# Altium project 20bit_40MS_ADC_DIOT.PrjPcb (part 2 of 5)

## Sheet ADC.SchDoc: AD4080
size A3; Author: M.Beldyga; CompanyName: Aescape, Inc.; DrawnBy: M.Beldyga; Organization: Aescape, Inc.; Address1: Aescape, Inc.; Address2: 581 6th Ave, New York, NY 10011; Address3: michal@aescape.com; SheetNumber: 2; SheetTotal: 10; ModifiedBy: -; CheckedDate: -; Title2: 20b 40Msps ADC; DivGrp: Aescape, Inc.; Designer: M.Beldyga; ModifiedDate: -; ProjectName: Sensor Box
Used 2 times, as channels U_ADC, U_ADC. Parts and nets are listed once, with the designators drawn on the sheet.
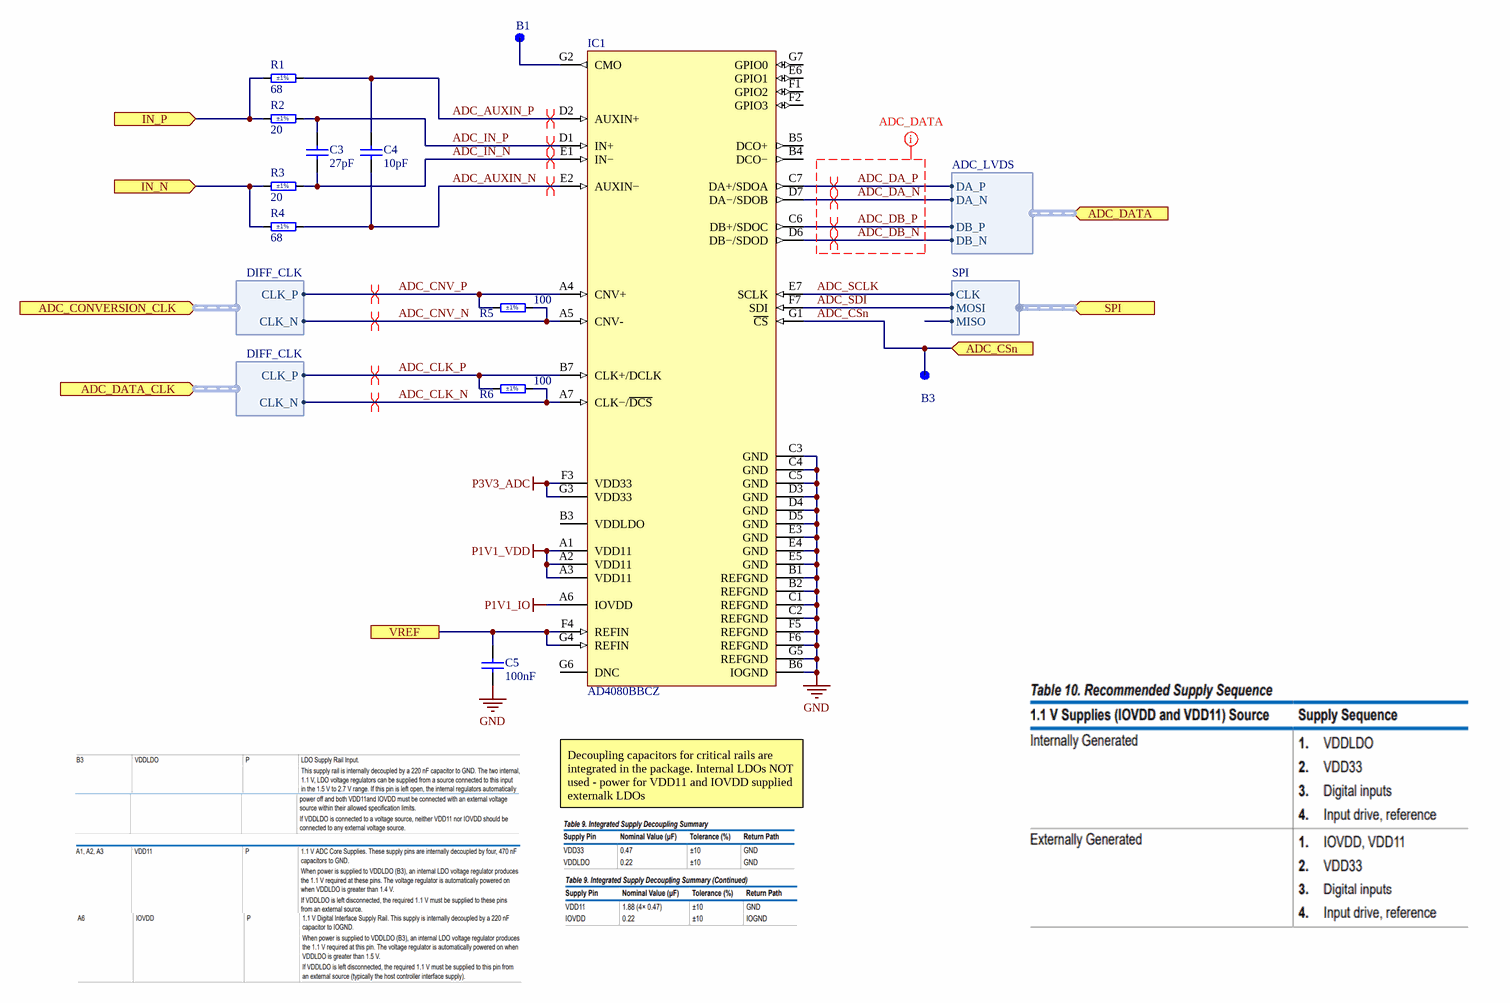
[diagram p4: ADC.SchDoc]

### Parts
B1  SMD Pad  [C100]  (value not drawn)  (no BOM)
B3  SMD Pad  [C100]  (value not drawn)  (no BOM)
C3  27pF  [CAPC1005X55N]
C4  10pF  [CAPC1005X55N]
C5  100nF  [CAPC1005X55N]
IC1  AD4080BBCZ  [BGA49C65P7X7_500X500X138]
R1  68  Tolerance: ±1%  [RESC1005X40N]
R2  20  Tolerance: ±1%  [RESC1005X40N]
R3  20  Tolerance: ±1%  [RESC1005X40N]
R4  68  Tolerance: ±1%  [RESC1005X40N]
R5  100  Tolerance: ±1%  [RESC1005X40N]
R6  100  Tolerance: ±1%  [RESC1005X40N]

### Ports
ADC_CONVERSION_CLK (in, harness DIFF_CLK), ADC_CSn (in), ADC_DATA (in, harness ADC_LVDS), ADC_DATA_CLK (in, harness DIFF_CLK), IN_N (in), IN_P (in), SPI (in, harness SPI), VREF

### Harnesses
ADC_LVDS: DA_P, DA_N, DB_P, DB_N
DIFF_CLK: CLK_P, CLK_N
SPI: CLK, MOSI, MISO

### Nets
GND: C5.1 IC1.B1(REFGND) IC1.B2(REFGND) IC1.B6(IOGND) IC1.C1(REFGND) IC1.C2(REFGND) IC1.C3(GND) IC1.C4(GND) IC1.C5(GND) IC1.D3(GND) IC1.D4(GND) IC1.D5(GND) IC1.E3(GND) IC1.E4(GND) IC1.E5(GND) IC1.F5(REFGND) IC1.F6(REFGND) IC1.G5(REFGND)
P1V1_IO: IC1.A6(IOVDD)
P1V1_VDD: IC1.A1(VDD11) IC1.A2(VDD11) IC1.A3(VDD11)
P3V3_ADC: IC1.F3(VDD33) IC1.G3(VDD33)
ADC_AUXIN_N: C4.1 IC1.E2(AUXIN−) R4.2
ADC_AUXIN_P: C4.2 IC1.D2(AUXIN+) R1.2
ADC_CLK_N: IC1.A7(CLK−/~{DCS}) R6.2 ; port ADC_DATA_CLK.CLK_N
ADC_CLK_P: IC1.B7(CLK+/DCLK) R6.1 ; port ADC_DATA_CLK.CLK_P
ADC_CNV_N: IC1.A5(CNV-) R5.2 ; port ADC_CONVERSION_CLK.CLK_N
ADC_CNV_P: IC1.A4(CNV+) R5.1 ; port ADC_CONVERSION_CLK.CLK_P
ADC_CSn: B3.1 IC1.G1(~{CS}) ; port ADC_CSn
ADC_DA_N: IC1.D7(DA−/SDOB) ; port ADC_DATA.DA_N
ADC_DA_P: IC1.C7(DA+/SDOA) ; port ADC_DATA.DA_P
ADC_DB_N: IC1.D6(DB−/SDOD) ; port ADC_DATA.DB_N
ADC_DB_P: IC1.C6(DB+/SDOC) ; port ADC_DATA.DB_P
ADC_IN_N: C3.1 IC1.E1(IN−) R3.2
ADC_IN_P: C3.2 IC1.D1(IN+) R2.2
ADC_SCLK: IC1.E7(SCLK) ; port SPI.CLK
ADC_SDI: IC1.F7(SDI) ; port SPI.MOSI
IN_N: R3.1 R4.1 ; port IN_N
IN_P: R1.1 R2.1 ; port IN_P
VREF: C5.2 IC1.F4(REFIN) IC1.G4(REFIN) ; port VREF
NetB1_1: B1.1 IC1.G2(CMO)

Not connected (* = marked no-connect by the designer): IC1 B3(VDDLDO) B4(DCO−) B5(DCO+) E6(GPIO1) F1(GPIO2) F2(GPIO3) G6(DNC) G7(GPIO0)

### Channels
U_ADC: designators end in B; ports ADC_CSn=ADC_CSn IN_N=ADCIN_N IN_P=ADCIN_P VREF=P3V0_REF
U_ADC: designators end in A; ports ADC_CSn=ADC_CSn IN_N=ADCIN_N IN_P=ADCIN_P VREF=P3V0_REF

### Layout directives
differential pair; net class ADC_IN: ADC_AUXIN_N_U_ADC, ADC_AUXIN_P_U_ADC, ADC_IN_N_U_ADC, ADC_IN_P_U_ADC
differential pair; net class D100: AD9508_OUT0_N, AD9508_OUT0_P, AD9508_OUT1_N, AD9508_OUT1_P, ADC_DA_N, ADC_DA_P, ADC_DB_N, ADC_DB_P
net class ADC_DATA: ADC_DA_N, ADC_DA_P, ADC_DB_N, ADC_DB_P

### Notes on the sheet
- Decoupling capacitors for critical rails are integrated in the package. Internal LDOs NOT used - power for VDD11 and IOVDD supplied externalk LDOs
- Project/Equipment
- Document
- Designer
- Drawn by
- Check.by
- Contact
- File
- Last Mod.
- Print Date
- Sheet
- Size
- A3
- of
- Rev

### Library data of the parts
B1 B3 = SMD_PAD_D1MM: as B4 on sheet LNA; Part Number: SMD_PAD_D1MM; Component Type: Standard (No BOM); Pin Count: 1; Family: SMD Pad; Socket: No; SMD: Yes; Sense: No; Status: None; ComponentHeight: 0mm; HelpURL: Undefined; Author: CERN DEM JLC; CreateDate: 10/10/2017; LatestRevisionDate: 10/10/2017; PackageDescription: 1mm Diameter SMD Pad
C3 = CC0402_27PF_50V_5%_C0G: Non-polarised capacitor; Part Description: SMD Multilayer Chip Ceramic Capacitor; Manufacturer: GENERIC; Manufacturer1 Part Number: C0402C270J5GACTU; Voltage: 50V; TC: C0G/NP0; Tolerance: ±5%; Part Number: CC0402_27PF_50V_5%_C0G; Component Kind: Standard; Component Type: Standard; Pin Count: 2; Value: 27pF; Status: Preferred; Manufacturer Part Number: CC0402_27PF_50V_5%_C0G; Case: 0402; Mounted: Yes; Socket: No; SMD: Yes; Sense: No; Manufacturer1 Example: KEMET; Manufacturer1 ComponentHeight: 0.55mm; HelpURL: \\cern.ch\dfs\Applications\Altium\Datasheets\CC0402_C0G_KEMET_(Commercial Grade).pdf; Author: CERN DEM JLC; CreateDate: 10/25/2012; LatestRevisionDate: 4/22/2015
C4 = CC0402_10PF_50V_5%_C0G: Non-polarised capacitor; Part Description: SMD Multilayer Chip Ceramic Capacitor; Manufacturer: GENERIC; Manufacturer1 Part Number: C0402C100J5GACTU; Voltage: 50V; TC: C0G/NP0; Tolerance: ±5%; Part Number: CC0402_10PF_50V_5%_C0G; Component Kind: Standard; Component Type: Standard; Pin Count: 2; Value: 10pF; Status: Preferred; Manufacturer Part Number: CC0402_10PF_50V_5%_C0G; Case: 0402; Mounted: Yes; Socket: No; SMD: Yes; Sense: No; Manufacturer1 Example: KEMET; Manufacturer1 ComponentHeight: 0.55mm; HelpURL: \\cern.ch\dfs\Applications\Altium\Datasheets\CC0402_C0G_KEMET_(Commercial Grade).pdf; Author: CERN DEM JLC; CreateDate: 12/3/2007; LatestRevisionDate: 4/22/2015
C5 = CC0402_100NF_50V_10%_X7R: as C1 on sheet CPCIS_Connectors_P1_P6; Part Number: CC0402_100NF_50V_10%_X7R; Component Kind: Standard; Component Type: Standard; Pin Count: 2; Value: 100nF; Status: None; Manufacturer Part Number: CC0402_100NF_50V_10%_X7R; Case: 0402; Mounted: Yes; Socket: No; SMD: Yes; Sense: No; Manufacturer1 Example: MURATA; Manufacturer1 ComponentHeight: 0.55mm; HelpURL: \\cern.ch\dfs\Applications\Altium\Datasheets\CC0402_MURATA_GRM155R71H104KE14D.pdf; Author: CERN DEM MR; CreateDate: 6/30/2017; LatestRevisionDate: 6/30/2017
IC1 = AD4080BBCZ: 20-Bit, 40 MSPS, Differential SAR ADC; Manufacturer: Analog Devices; Part Number: AD4080BBCZ; Component Kind: Standard; Component Type: Standard; Device: AD4080BBCZ; PackageDescription: BGA, 49-Leads, Body 5.00x5.00mmx1.38mm, Pitch 0.65mm; Part Description: 20-Bit, 40 MSPS, Differential SAR ADC; Manufacturer Part Number: AD4080BBCZ; Pin Count: 49; Case: BGA; Status: Active; Author: Michal Beldyga; CreateDate: 1/31/2025; LastRevision: 1/31/2025
R1 R4 = R0402_68R_1%_0.0625W_100PPM: Resistor - 1%; Part Description: General Purpose Thick Film Chip Resistor; Manufacturer: GENERIC; Manufacturer1 Part Number: 232270676809L; TC: ±100ppm/°C; PressFit: No; Part Number: R0402_68R_1%_0.0625W_100PPM; Component Kind: Standard; Component Type: Standard; Pin Count: 2; Value: 68; Status: Not Recommended; Power: 0.0625W; Manufacturer Part Number: R0402_68R_1%_0.0625W_100PPM; Case: 0402; Mounted: Yes; Sense: No; Socket: No; SMD: Yes; Manufacturer1 Example: YAGEO PHYCOMP; Manufacturer1 ComponentHeight: 0.4mm; HelpURL: \\cern.ch\dfs\Applications\Altium\Datasheets\R0402_Phycomp_RC0402.pdf; Author: CERN DEM JLC; CreateDate: 12/3/2007; LatestRevisionDate: 10/17/2012
R2 R3 = R0402_20R_1%_0.0625W_100PPM: Resistor - 1%; Part Description: General Purpose Thick Film Chip Resistor; Manufacturer: GENERIC; Manufacturer1 Part Number: 232270672009L; TC: ±100ppm/°C; PressFit: No; Part Number: R0402_20R_1%_0.0625W_100PPM; Component Kind: Standard; Component Type: Standard; Pin Count: 2; Value: 20; Status: Not Recommended; Power: 0.0625W; Manufacturer Part Number: R0402_20R_1%_0.0625W_100PPM; Case: 0402; Mounted: Yes; Sense: No; Socket: No; SMD: Yes; Manufacturer1 Example: YAGEO PHYCOMP; Manufacturer1 ComponentHeight: 0.4mm; HelpURL: \\cern.ch\dfs\Applications\Altium\Datasheets\R0402_Phycomp_RC0402.pdf; Author: CERN DEM JLC; CreateDate: 12/3/2007; LatestRevisionDate: 10/17/2012
R5 R6 = R0402_100R_1%_0.1W_100PPM: Resistor - 1%; Part Description: General Purpose Thick Film Chip Resistor; Manufacturer: GENERIC; Manufacturer Part Number: R0402_100R_1%_0.1W_100PPM_50V; Manufacturer1 Part Number: ERJ2RKF1000X; Power: 0.1W; TC: ±100ppm/°C; Voltage: 50V; PressFit: No; Part Number: R0402_100R_1%_0.1W_100PPM; Component Kind: Standard; Component Type: Standard; Pin Count: 2; Value: 100; Status: Not Recommended; Case: 0402; Mounted: Yes; Sense: No; Socket: No; SMD: Yes; Manufacturer1 Example: PANASONIC; Manufacturer1 ComponentHeight: 0.4mm; HelpURL: \\cern.ch\dfs\Applications\Altium\Datasheets\R0402_PANASONIC_ERJ2RK.pdf; Author: CERN DEM JLC; CreateDate: 12/12/2013; LatestRevisionDate: 3/3/2015

## Sheet PLL.SchDoc: PLL
size A3; Author: M.Beldyga; CompanyName: WUT ISE; DrawnBy: M.Beldyga; Organization: WUT ISE; Address1: PW ISE; Address2: Nowowiejska 15/19 00-665 Warsaw; Address3: micbeldyga@gmail.com; SheetNumber: 5; SheetTotal: 10; ModifiedBy: -; CheckedDate: -; Title2: ADC clocks; DivGrp: WUT ISE; Designer: M.Beldyga; SPICEModelCacheKGJAJCJD: <root> / <DocumentId>KGJAJCJD</DocumentId> / </root>; ModifiedDate: -; ProjectName: Sensor Box
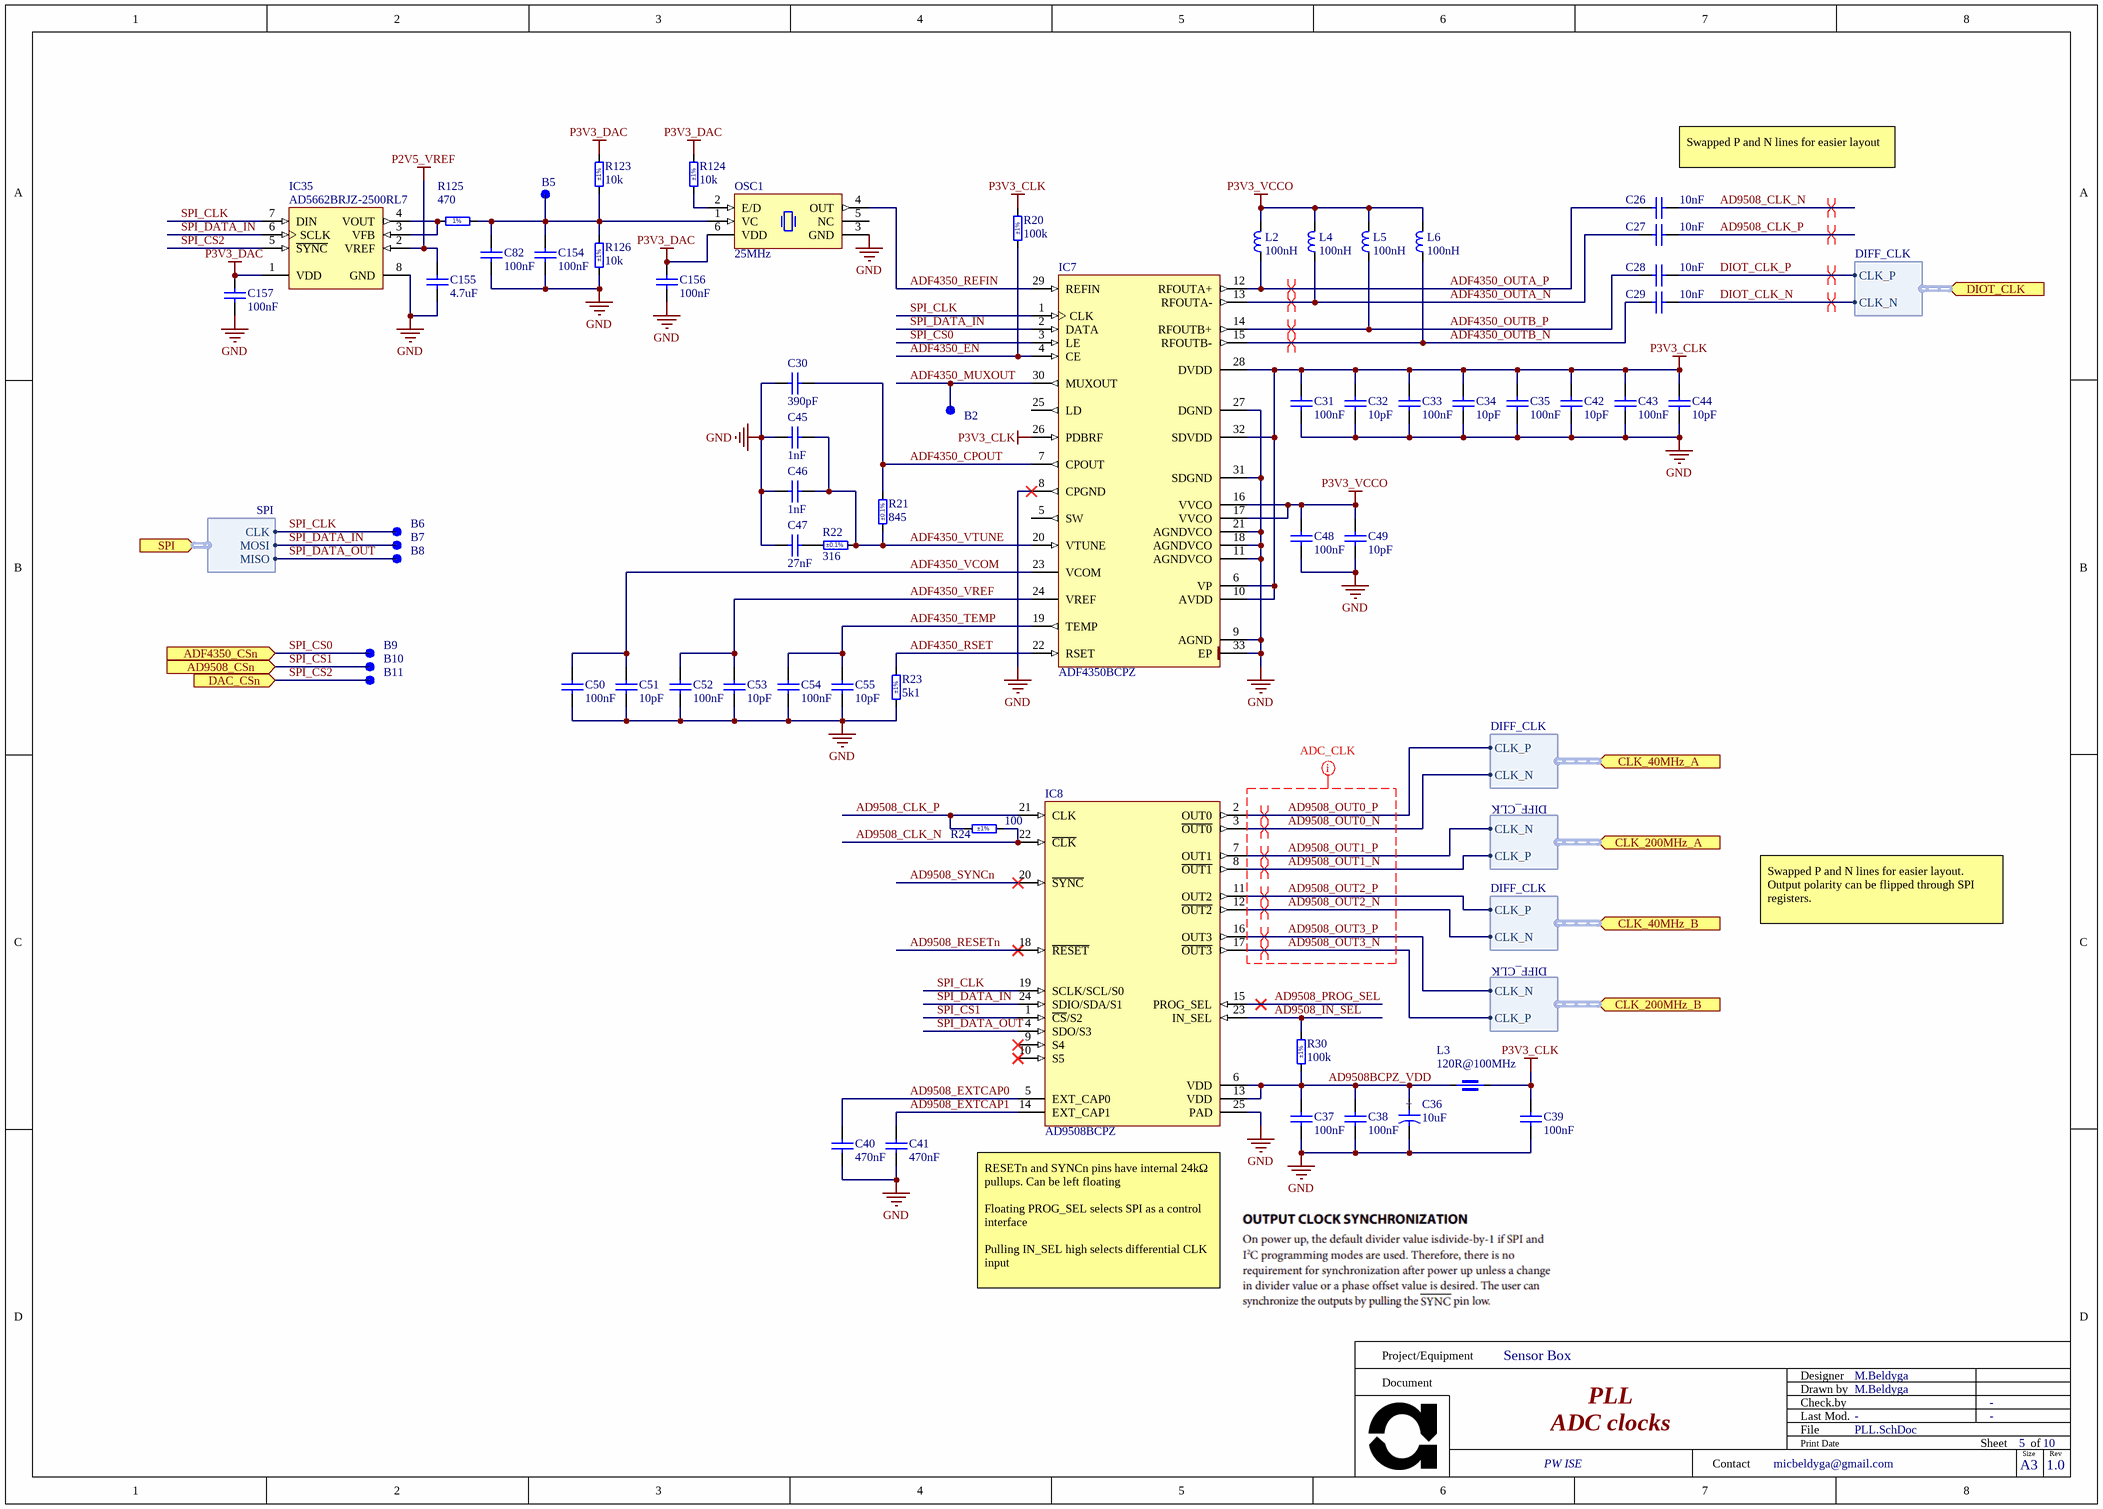
[diagram p5: PLL.SchDoc]

### Parts
B2  SMD Pad  [C100]  (value not drawn)  (no BOM)
B5  SMD Pad  [C100]  (value not drawn)  (no BOM)
B6  SMD Pad  [C100]  (value not drawn)  (no BOM)
B7  SMD Pad  [C100]  (value not drawn)  (no BOM)
B8  SMD Pad  [C100]  (value not drawn)  (no BOM)
B9  SMD Pad  [C100]  (value not drawn)  (no BOM)
B10  SMD Pad  [C100]  (value not drawn)  (no BOM)
B11  SMD Pad  [C100]  (value not drawn)  (no BOM)
C26  10nF  [CAPC1005X55N]
C27  10nF  [CAPC1005X55N]
C28  10nF  [CAPC1005X55N]
C29  10nF  [CAPC1005X55N]
C30  390pF  [CAPC1005X55N]
C31  100nF  [CAPC1005X55N]
C32  10pF  [CAPC1005X55N]
C33  100nF  [CAPC1005X55N]
C34  10pF  [CAPC1005X55N]
C35  100nF  [CAPC1005X55N]
C36  10uF  [CAPMP3216X180N]
C37  100nF  [CAPC1005X55N]
C38  100nF  [CAPC1005X55N]
C39  100nF  [CAPC1005X55N]
C40  470nF  [CAPC1005X55N]
C41  470nF  [CAPC1005X55N]
C42  10pF  [CAPC1005X55N]
C43  100nF  [CAPC1005X55N]
C44  10pF  [CAPC1005X55N]
C45  1nF  [CAPC1608X90N]
C46  1nF  [CAPC1608X90N]
C47  27nF  [CAPC1005X55N]
C48  100nF  [CAPC1005X55N]
C49  10pF  [CAPC1005X55N]
C50  100nF  [CAPC1005X55N]
C51  10pF  [CAPC1005X55N]
C52  100nF  [CAPC1005X55N]
C53  10pF  [CAPC1005X55N]
C54  100nF  [CAPC1005X55N]
C55  10pF  [CAPC1005X55N]
C82  100nF  [CAPC1005X55N]
C154  100nF  [CAPC1005X55N]
C155  4.7uF  [CAPC1608X90N]
C156  100nF  [CAPC1005X55N]
C157  100nF  [CAPC1005X55N]
IC7  ADF4350BCPZ  [QFN50P500X500X80-33N-S325]
IC8  AD9508BCPZ  [QFN50P400X400X80_HS-25N]
IC35  AD5662BRJZ-2500RL7  [SOT65P280X145-8N]
L2  100nH  [INDC1005X55N]
L3  120R@100MHz  [INDC1608X65N]
L4  100nH  [INDC1005X55N]
L5  100nH  [INDC1005X55N]
L6  100nH  [INDC1005X55N]
OSC1  25MHz  [OSC_PERICOM_FRETHE025]
R20  100k  Tolerance: ±1%  [RESC1005X40N]
R21  845  Tolerance: ±0.1%  [RESC1608X55N]
R22  316  Tolerance: ±0.1%  [RESC1608X55N]
R23  5k1  Tolerance: ±1%  [RESC1005X40N]
R24  100  Tolerance: ±1%  [RESC1005X40N]
R30  100k  Tolerance: ±1%  [RESC1005X40N]
R123  10k  Tolerance: ±1%  [RESC1005X40N]
R124  10k  Tolerance: ±1%  [RESC1005X40N]
R125  470  [RESC1005X40N]
R126  10k  Tolerance: ±1%  [RESC1005X40N]

### Ports
AD9508_CSn (in), ADF4350_CSn (in), CLK_40MHz_A (in, harness DIFF_CLK), CLK_40MHz_B (in, harness DIFF_CLK), CLK_200MHz_A (in, harness DIFF_CLK), CLK_200MHz_B (in, harness DIFF_CLK), DAC_CSn (in), DIOT_CLK (in, harness DIFF_CLK), SPI (in, harness SPI)

### Harnesses
DIFF_CLK: CLK_P, CLK_N
SPI: CLK, MOSI, MISO

### Nets
GND: C30.1 C31.1 C32.1 C33.1 C34.1 C35.1 C36.2 C37.1 C38.1 C39.1 C40.1 C41.1 C42.1 C43.1 C44.1 C45.1 C46.1 C47.1 C48.1 C49.1 C50.1 C51.1 C52.1 C53.1 C54.1 C55.1 C82.1 C154.1 C155.1 C156.1 C157.1 IC7.8(CPGND) IC7.9(AGND) IC7.11(AGNDVCO) IC7.18(AGNDVCO) IC7.21(AGNDVCO) IC7.27(DGND) IC7.31(SDGND) IC7.33(EP) IC8.25(PAD) IC35.8(GND) OSC1.3(GND) R23.1 R126.1
P2V5_VREF: C155.2 IC35.2(VREF)
P3V3_CLK: C31.2 C32.2 C33.2 C34.2 C35.2 C39.2 C42.2 C43.2 C44.2 IC7.6(VP) IC7.10(AVDD) IC7.26(PDBRF) IC7.28(DVDD) IC7.32(SDVDD) L3.1 R20.2
P3V3_DAC: C156.2 C157.2 IC35.1(VDD) OSC1.6(VDD) R123.2 R124.1
P3V3_VCCO: C48.2 C49.2 IC7.16(VVCO) IC7.17(VVCO) L2.2 L4.2 L5.2 L6.2
AD9508_CLK_N: C26.1 IC8.22(~{CLK}) R24.2
AD9508_CLK_P: C27.1 IC8.21(CLK) R24.1
AD9508_EXTCAP0: C40.2 IC8.5(EXT_CAP0)
AD9508_EXTCAP1: C41.2 IC8.14(EXT_CAP1)
AD9508_IN_SEL: IC8.23(IN_SEL) R30.2
AD9508_OUT0_N: IC8.3(~{OUT0}) ; port CLK_40MHz_A.CLK_N
AD9508_OUT0_P: IC8.2(OUT0) ; port CLK_40MHz_A.CLK_P
AD9508_OUT1_N: IC8.8(~{OUT1}) ; port CLK_200MHz_A.CLK_P
AD9508_OUT1_P: IC8.7(OUT1) ; port CLK_200MHz_A.CLK_N
AD9508_OUT2_N: IC8.12(~{OUT2}) ; port CLK_40MHz_B.CLK_N
AD9508_OUT2_P: IC8.11(OUT2) ; port CLK_40MHz_B.CLK_P
AD9508_OUT3_N: IC8.17(~{OUT3}) ; port CLK_200MHz_B.CLK_P
AD9508_OUT3_P: IC8.16(OUT3) ; port CLK_200MHz_B.CLK_N
AD9508_PROG_SEL: IC8.15(PROG_SEL)
AD9508_RESETn: IC8.18(~{RESET})
AD9508_SYNCn: IC8.20(~{SYNC})
AD9508BCPZ_VDD: C36.1 C37.2 C38.2 IC8.6(VDD) IC8.13(VDD) L3.2 R30.1
ADF4350_CPOUT: C30.2 IC7.7(CPOUT) R21.1
ADF4350_EN: IC7.4(CE) R20.1
ADF4350_MUXOUT: B2.1 IC7.30(MUXOUT)
ADF4350_OUTA_N: C27.2 IC7.13(RFOUTA-) L4.1
ADF4350_OUTA_P: C26.2 IC7.12(RFOUTA+) L2.1
ADF4350_OUTB_N: C29.2 IC7.15(RFOUTB-) L6.1
ADF4350_OUTB_P: C28.2 IC7.14(RFOUTB+) L5.1
ADF4350_REFIN: IC7.29(REFIN) OSC1.4(OUT)
ADF4350_RSET: IC7.22(RSET) R23.2
ADF4350_TEMP: C54.2 C55.2 IC7.19(TEMP)
ADF4350_VCOM: C50.2 C51.2 IC7.23(VCOM)
ADF4350_VREF: C52.2 C53.2 IC7.24(VREF)
ADF4350_VTUNE: C45.2 C46.2 IC7.20(VTUNE) R21.2 R22.2
DIOT_CLK_N: C29.1 ; port DIOT_CLK.CLK_N
DIOT_CLK_P: C28.1 ; port DIOT_CLK.CLK_P
SPI_CLK: B6.1 IC7.1(CLK) IC8.19(SCLK/SCL/S0) IC35.7(DIN) ; port SPI.CLK  [project net ADC_SCLK]
SPI_CS0: B9.1 IC7.3(LE) ; port ADF4350_CSn  [project net CSn_AD4350]
SPI_CS1: B10.1 IC8.1(~{CS}/S2) ; port AD9508_CSn  [project net CSn_AD9508]
SPI_CS2: B11.1 IC35.5(~{SYNC}) ; port DAC_CSn  [project net CSn_DAC]
SPI_DATA_IN: B7.1 IC7.2(DATA) IC8.24(SDIO/SDA/S1) IC35.6(SCLK) ; port SPI.MOSI  [project net ADC_SDI]
SPI_DATA_OUT: B8.1 IC8.4(SDO/S3) ; port SPI.MISO  [project net LNA_MISO]
NetB5_1: B5.1 C82.2 C154.2 OSC1.1(VC) R123.1 R125.2 R126.2
NetC47_2: C47.2 R22.1
NetIC35_3: IC35.3(VFB) IC35.4(VOUT) R125.1
NetOSC1_2: OSC1.2(E/D) R124.2

Not connected (* = marked no-connect by the designer): IC7 5(SW) 25(LD); IC8 9(S4)* 10(S5)*; OSC1 5(NC)

### Layout directives
differential pair; net class D100: AD9508_CLK_N, AD9508_CLK_P, AD9508_OUT0_N, AD9508_OUT0_P, AD9508_OUT1_N, AD9508_OUT1_P, AD9508_OUT2_N, AD9508_OUT2_P, AD9508_OUT3_N, AD9508_OUT3_P, ADF4350_OUTA_N, ADF4350_OUTA_P, ADF4350_OUTB_N, ADF4350_OUTB_P, DIOT_CLK_N, DIOT_CLK_P
net class ADC_CLK: AD9508_OUT0_N, AD9508_OUT0_P, AD9508_OUT1_N, AD9508_OUT1_P, AD9508_OUT2_N, AD9508_OUT2_P, AD9508_OUT3_N, AD9508_OUT3_P

### Notes on the sheet
- (near C26) Swapped P and N lines for easier layout
- Swapped P and N lines for easier layout. Output polarity can be flipped through SPI registers.
- (near IC8) RESETn and SYNCn pins have internal 24kΩ pullups. Can be left floating
  Floating PROG_SEL selects SPI as a control interface
  Pulling IN_SEL high selects differential CLK input
- Project/Equipment
- Document
- Designer
- Drawn by
- Check.by
- Contact
- File
- Last Mod.
- Print Date
- Sheet
- Size
- A3
- of
- Rev
- (in symbol CTE3216-18_10UF_16V_20%_AVX_TCJ) +
- (in symbol R0402_470R_1%_0.0625W_100PPM) 1%

### Library data of the parts
B2 B5-B11 = SMD_PAD_D1MM: as B4 on sheet LNA; Part Number: SMD_PAD_D1MM; Component Type: Standard (No BOM); Pin Count: 1; Family: SMD Pad; Socket: No; SMD: Yes; Sense: No; Status: None; ComponentHeight: 0mm; HelpURL: Undefined; Author: CERN DEM JLC; CreateDate: 10/10/2017; LatestRevisionDate: 10/10/2017; PackageDescription: 1mm Diameter SMD Pad
C26-C29 = CC0402_10NF_16V_10%_X7R: Non-polarised capacitor; Part Description: SMD Multilayer Chip Ceramic Capacitor; Manufacturer: GENERIC; Manufacturer1 Part Number: 223878715636; Voltage: 16V; TC: X7R; Tolerance: ±10%; Part Number: CC0402_10NF_16V_10%_X7R; Component Kind: Standard; Component Type: Standard; Pin Count: 2; Value: 10nF; Status: Not Recommended; Manufacturer Part Number: CC0402_10NF_16V_10%_X7R; Case: 0402; Mounted: Yes; Socket: No; SMD: Yes; Sense: No; Manufacturer1 Example: PHYCOMP; Manufacturer1 ComponentHeight: 0.55mm; HelpURL: \\cern.ch\dfs\Applications\Altium\Datasheets\CC0402_X7R_PHYCOMP.pdf; Author: CERN DEM JLC; CreateDate: 12/3/2007; LatestRevisionDate: 12/3/2007
C30 = CC0402_390PF_50V_1%_C0G_MURATA_GCM1555C1H391FA16: Non-polarised capacitor; Part Description: Chip Multilayer Ceramic Capacitor for Automotive; Manufacturer: MURATA; Voltage: 50V; TC: C0G/NP0; Tolerance: ±1%; Part Number: CC0402_390PF_50V_1%_C0G_MURATA_GCM1555C1H391FA16; Component Kind: Standard; Component Type: Standard; Pin Count: 2; Value: 390pF; Status: None; Manufacturer Part Number: GCM1555C1H391FA16; Case: 0402; Mounted: Yes; Socket: No; SMD: Yes; Sense: No; ComponentHeight: 0.55mm; HelpURL: \\cern.ch\dfs\Applications\Altium\Datasheets\CC0402_MURATA_GCM1555C1H391FA16.pdf; Author: CERN DEM BC; CreateDate: 9/2/2020; LatestRevisionDate: 9/2/2020
C31 C33 C35 C37-C39 C43 C48 C50 C52 C54 C82 C154 C156 C157 = CC0402_100NF_50V_10%_X7R: as C1 on sheet CPCIS_Connectors_P1_P6; Part Number: CC0402_100NF_50V_10%_X7R; Component Kind: Standard; Component Type: Standard; Pin Count: 2; Value: 100nF; Status: None; Manufacturer Part Number: CC0402_100NF_50V_10%_X7R; Case: 0402; Mounted: Yes; Socket: No; SMD: Yes; Sense: No; Manufacturer1 Example: MURATA; Manufacturer1 ComponentHeight: 0.55mm; HelpURL: \\cern.ch\dfs\Applications\Altium\Datasheets\CC0402_MURATA_GRM155R71H104KE14D.pdf; Author: CERN DEM MR; CreateDate: 6/30/2017; LatestRevisionDate: 6/30/2017
C32 C34 C42 C44 C49 C51 C53 C55 = CC0402_10PF_50V_5%_C0G: as C4 on sheet ADC; Part Number: CC0402_10PF_50V_5%_C0G; Component Kind: Standard; Component Type: Standard; Pin Count: 2; Value: 10pF; Status: Preferred; Manufacturer Part Number: CC0402_10PF_50V_5%_C0G; Case: 0402; Mounted: Yes; Socket: No; SMD: Yes; Sense: No; Manufacturer1 Example: KEMET; Manufacturer1 ComponentHeight: 0.55mm; HelpURL: \\cern.ch\dfs\Applications\Altium\Datasheets\CC0402_C0G_KEMET_(Commercial Grade).pdf; Author: CERN DEM JLC; CreateDate: 12/3/2007; LatestRevisionDate: 4/22/2015
C36 = CTE3216-18_10UF_16V_20%_AVX_TCJ: Polarised capacitor; Part Description: ESR 0R200 Tantalum Solid Electrolytic Chip Capacitor with Conductive Polymer Electrode; Manufacturer: AVX; Manufacturer Part Number: TCJA106M016R0200; Voltage: 16V; Tolerance: ±20%; Part Number: CTE3216-18_10UF_16V_20%_AVX_TCJ; Component Kind: Standard; Component Type: Standard; Pin Count: 2; Value: 10uF; Status: Preferred; Case: A; Mounted: Yes; Socket: No; SMD: Yes; Sense: No; ComponentHeight: 1.8mm; HelpURL: \\cern.ch\dfs\Applications\Altium\Datasheets\CTE_AVX_TCJ.pdf; Author: CERN DEM JLC; CreateDate: 3/29/2012; LatestRevisionDate: 3/29/2012
C40 C41 = CC0402_470NF_16V_10%_X5R: Non-polarised capacitor; Part Description: SMD Multilayer Chip Ceramic Capacitor; Manufacturer: GENERIC; Manufacturer1 Part Number: C1005X5R1C105KT; Voltage: 16V; TC: X5R; Tolerance: ±10%; Part Number: CC0402_470NF_16V_10%_X5R; Component Kind: Standard; Component Type: Standard; Pin Count: 2; Value: 470nF; Status: Preferred; Manufacturer Part Number: CC0402_470NF_16V_10%_X5R; Case: 0402; Mounted: Yes; Socket: No; SMD: Yes; Sense: No; Manufacturer1 Example: TDK; Manufacturer1 ComponentHeight: 0.55mm; HelpURL: \\cern.ch\dfs\Applications\Altium\Datasheets\CC0402_X5R_TDK_C.pdf; Author: CERN DEM JLC; CreateDate: 10/25/2012; LatestRevisionDate: 10/25/2012
C45 C46 = CC0603_1NF_50V_1%_NP0: Non-polarised capacitor; Part Description: SMD Multilayer Chip Ceramic Capacitor; Manufacturer: GENERIC; Manufacturer1 Part Number: 06035A102FAT2A; Voltage: 50V; TC: C0G/NP0; Tolerance: ±1%; Part Number: CC0603_1NF_50V_1%_NP0; Component Kind: Standard; Component Type: Standard; Pin Count: 2; Value: 1nF; Status: None; Manufacturer Part Number: CC0603_1NF_50V_1%_NP0; Case: 0603; Mounted: Yes; Socket: No; SMD: Yes; Sense: No; Manufacturer1 Example: AVX; Manufacturer1 ComponentHeight: 0.9mm; HelpURL: \\cern.ch\dfs\Applications\Altium\Datasheets\CC0603_C0G_AVX.pdf; Author: CERN DEM JLC; CreateDate: 6/15/2017; LatestRevisionDate: 6/15/2017
C47 = CC0402_27NF_25V_10%_X7R: Non-polarised capacitor; Part Description: SMD Multilayer Chip Ceramic Capacitor; Manufacturer: GENERIC; Manufacturer1 Part Number: C0402C273K3RACTU; Voltage: 25V; TC: X7R; Tolerance: ±10%; Part Number: CC0402_27NF_25V_10%_X7R; Component Kind: Standard; Component Type: Standard; Pin Count: 2; Value: 27nF; Status: Preferred; Manufacturer Part Number: CC0402_27NF_25V_10%_X7R; Case: 0402; Mounted: Yes; Socket: No; SMD: Yes; Sense: No; Manufacturer1 Example: KEMET; Manufacturer1 ComponentHeight: 0.55mm; HelpURL: \\cern.ch\dfs\Applications\Altium\Datasheets\CC0402_X7R_KEMET.pdf; Author: CERN DEM JLC; CreateDate: 3/9/2017; LatestRevisionDate: 3/9/2017
C155 = CC0603_4.7UF_25V_10%_X5R: Non-polarised capacitor; Part Description: SMD Multilayer Chip Ceramic Capacitor; Manufacturer: GENERIC; Manufacturer1 Part Number: GRM188R61E475KE11D; Voltage: 25V; TC: X5R; Tolerance: ±10%; Part Number: CC0603_4.7UF_25V_10%_X5R; Component Kind: Standard; Component Type: Standard; Pin Count: 2; Value: 4.7uF; Status: None; Manufacturer Part Number: CC0603_4.7UF_25V_10%_X5R; Case: 0603; Mounted: Yes; Socket: No; SMD: Yes; Sense: No; Manufacturer1 Example: MURATA; Manufacturer1 ComponentHeight: 0.95mm; HelpURL: \\cern.ch\dfs\Applications\Altium\Datasheets\CC0603_MURATA_GRM188R61E475KE11D.pdf; Author: CERN DEM JLC; CreateDate: 11/10/2014; LatestRevisionDate: 11/10/2014
IC7 = ADF4350BCPZ: Wideband Synthesizer with Integrated VCO; Manufacturer: Analog Devices; Manufacturer Part Number: ADF4351BCP; Part Number: ADF4350BCPZ; Component Kind: Standard; Component Type: Standard; Device: ADF4350BCPZ; PackageDescription: QFN, (MO-220-WHHD) 0.50mm Pitch, Square; 32 Pin, 5.00mm L X 5.00mm W X 0.80mm H body (w/Thermal Tab 3.25 X 3.25mm), IPC Medium Density; Part Description: Wideband Synthesizer with Integrated VCO; Pin Count: 33; Case: QFN; Status: Active; Author: Michal Beldyga; CreateDate: 2/17/2025; LastRevision: 2/17/2025
IC8 = AD9508BCPZ: 1.65 GHz Clock Fanout Buffer with Output Dividers and Delay Adjust; Manufacturer: Analog Devices; Part Number: AD9508BCPZ; Component Kind: Standard; Component Type: Standard; Device: AD9508BCPZ; PackageDescription: QFN, 24-Leads, Body 4.00x4.00mm, Pitch 0.50mm, Thermal Pad 2.30x2.30mm, IPC Medium Density; Part Description: 1.65 GHz Clock Fanout Buffer with Output Dividers and Delay Adjust; Manufacturer Part Number: AD9508BCPZ; Pin Count: 25; Case: QFN; Status: Active; Author: Michal Beldyga; CreateDate: 2/8/2025; LastRevision: 2/8/2025
IC35 = AD5662BRJZ-2500RL7: 2.7V to 5.5V, 250µA, Rail-to-Rail Output 16-Bit nanoDAC; Manufacturer: ANALOG DEVICES; PressFit: No; Bonding: No; Part Number: AD5662BRJZ-2500RL7; Component Kind: Standard; Component Type: Standard; Device: AD5662BRJZ-2500RL7; PackageDescription: SOT, 0.65mm pitch; 8 pin, 1.625mm W X 2.90mm L X 1.45mm H body, IPC Medium Density; Part Description: 2.7V to 5.5V, 250μA, Rail-to-Rail Output 16-Bit nanoDAC; Manufacturer Part Number: AD5662BRJZ-2; Pin Count: 8; Case: SOT23-8; Mounted: Yes; Socket: No; SMD: Yes; Sense: No; ComponentHeight: 1.45mm; Author: CERN DEM JLC; HelpURL: \\cern.ch\dfs\Applications\Altium\Datasheets\AD5662BRJZ-2500RL7.pdf; CreateDate: 5/9/2012; LatestRevisionDate: 3/25/2022
L2 L4-L6 = IND0402_100NH_5%_JOHANSON_ L-07CR10JV6T: Inductor; Part Description: RF Ceramic Chip Inductor; Manufacturer: Johanson Technology; Manufacturer Part Number: LRC0402CJR10GV001T; Current: 100mA; Tolerance: ±5%; Part Number: IND0402_100NH_5%_JOHANSON_ L-07CR10JV6T; Component Kind: Standard; Component Type: Standard; Pin Count: 2; Value: 100nH; DC Resistance: N/A; Status: Active; ComponentHeight: 0.5mm; SMD: Yes; Author: Michal Beldyga; CreateDate: 2/17/2025; LatestRevisionDate: 2/17/2025
L3 = IND0603_MURATA_BLM18SG121TN1D: Part Description: SMD EMIFIL Suppression Chip Ferrite Bead; Manufacturer: MURATA; Power: 3A; Resistance: 0.025R; Tolerance: ±25%; Part Number: IND0603_MURATA_BLM18SG121TN1D; Component Kind: Standard; Component Type: Standard; Pin Count: 2; Value: 120R@100MHz; Manufacturer Part Number: BLM18SG121TN1D; Case: 0603; Mounted: Yes; Socket: No; SMD: Yes; Sense: No; ComponentHeight: 0.65mm; HelpURL: \\cern.ch\dfs\Applications\Altium\Datasheets\IND0603_MURATA_BLM18S.pdf; Author: CERN DEM JLC; CreateDate: 7/23/2014; LatestRevisionDate: 10/25/2018
OSC1 = OSC_25MHZ_PERICOM_FRETHE025: 3.3V CMOS 25.000MHz Ethernet VCXO; Part Description: 3.3V, ±25ppm, 15pF, -20..70°C,CMOS Ethernet VCXO; PressFit: No; Bonding: No; Part Number: OSC_25MHZ_PERICOM_FRETHE025; Component Kind: Standard; Component Type: Standard; PackageDescription: SMD Oscillator, Side Concave; 2.54mm Pitch, 6 Pins, 5.00mm L X 7.00mm W X 1.55mm H; Value: 25MHz; Manufacturer: PERICOM; Manufacturer Part Number: FRETHE025; Pin Count: 6; Mounted: Yes; Socket: No; SMD: Yes; Sense: No; ComponentHeight: 1.55mm; HelpURL: \\cern.ch\dfs\Applications\Altium\Datasheets\OSC_PERICOM_FRETHE025.pdf; Author: CERN DEM JLC; CreateDate: 5/10/2012; LatestRevisionDate: 5/10/2012
R20 R30 = R0402_100K_1%_0.0625W_100PPM: as R14 on sheet AFE; Part Number: R0402_100K_1%_0.0625W_100PPM; Component Kind: Standard; Component Type: Standard; Pin Count: 2; Value: 100k; Status: Not Recommended; Power: 0.0625W; Manufacturer Part Number: R0402_100K_1%_0.0625W_100PPM; Case: 0402; Mounted: Yes; Sense: No; Socket: No; SMD: Yes; Manufacturer1 Example: YAGEO PHYCOMP; Manufacturer1 ComponentHeight: 0.4mm; HelpURL: \\cern.ch\dfs\Applications\Altium\Datasheets\R0402_Phycomp_RC0402.pdf; Author: CERN DEM JLC; CreateDate: 12/3/2007; LatestRevisionDate: 10/17/2012
R21 = R0603_845R_0.1%_0.063W_10PPM: Resistor - 0.1%; Part Description: Thin Film Chip Resistor; Manufacturer: GENERIC; Manufacturer1 Part Number: RN73C1J845RBTDF; Power: 0.063W; TC: ±10ppm; PressFit: No; Part Number: R0603_845R_0.1%_0.063W_10PPM; Component Kind: Standard; Component Type: Standard; Pin Count: 2; Value: 845; Status: Not Recommended; Manufacturer Part Number: R0603_845R_0.1%_0.063W_10PPM; Case: 0603; Mounted: Yes; Sense: No; Socket: No; SMD: Yes; Manufacturer1 Example: TYCO HOLSWORTHY; Manufacturer1 ComponentHeight: 0.5mm; HelpURL: \\cern.ch\dfs\Applications\Altium\Datasheets\R0603_Tyco_RN73.pdf; Author: CERN DEM JLC; CreateDate: 12/3/2007; LatestRevisionDate: 3/13/2008
R22 = R0603_316R_0.1%_0.063W_10PPM: Resistor - 0.1%; Part Description: Thin Film Chip Resistor; Manufacturer: GENERIC; Manufacturer1 Part Number: RN73C1J316RBTDF; Power: 0.063W; TC: ±10ppm; PressFit: No; Part Number: R0603_316R_0.1%_0.063W_10PPM; Component Kind: Standard; Component Type: Standard; Pin Count: 2; Value: 316; Status: Not Recommended; Manufacturer Part Number: R0603_316R_0.1%_0.063W_10PPM; Case: 0603; Mounted: Yes; Sense: No; Socket: No; SMD: Yes; Manufacturer1 Example: TYCO HOLSWORTHY; Manufacturer1 ComponentHeight: 0.5mm; HelpURL: \\cern.ch\dfs\Applications\Altium\Datasheets\R0603_Tyco_RN73.pdf; Author: CERN DEM JLC; CreateDate: 12/3/2007; LatestRevisionDate: 3/13/2008
R23 = R0402_5K1_1%_0.0625W_100PPM: Resistor - 1%; Part Description: General Purpose Thick Film Chip Resistor; Manufacturer: GENERIC; Manufacturer1 Part Number: 232270675102L; TC: ±100ppm/°C; PressFit: No; Part Number: R0402_5K1_1%_0.0625W_100PPM; Component Kind: Standard; Component Type: Standard; Pin Count: 2; Value: 5k1; Status: Not Recommended; Power: 0.0625W; Manufacturer Part Number: R0402_5K1_1%_0.0625W_100PPM; Case: 0402; Mounted: Yes; Sense: No; Socket: No; SMD: Yes; Manufacturer1 Example: YAGEO PHYCOMP; Manufacturer1 ComponentHeight: 0.4mm; HelpURL: \\cern.ch\dfs\Applications\Altium\Datasheets\R0402_Phycomp_RC0402.pdf; Author: CERN DEM JLC; CreateDate: 12/3/2007; LatestRevisionDate: 10/17/2012
R24 = R0402_100R_1%_0.1W_100PPM: as R5 on sheet ADC; Part Number: R0402_100R_1%_0.1W_100PPM; Component Kind: Standard; Component Type: Standard; Pin Count: 2; Value: 100; Status: Not Recommended; Case: 0402; Mounted: Yes; Sense: No; Socket: No; SMD: Yes; Manufacturer1 Example: PANASONIC; Manufacturer1 ComponentHeight: 0.4mm; HelpURL: \\cern.ch\dfs\Applications\Altium\Datasheets\R0402_PANASONIC_ERJ2RK.pdf; Author: CERN DEM JLC; CreateDate: 12/12/2013; LatestRevisionDate: 3/3/2015
R123 R124 R126 = R0402_10K_1%_0.0625W_100PPM: Resistor - 1%; Part Description: General Purpose Thick Film Chip Resistor; Manufacturer: GENERIC; Manufacturer1 Part Number: 232270671003L; TC: ±100ppm/°C; PressFit: No; Part Number: R0402_10K_1%_0.0625W_100PPM; Component Kind: Standard; Component Type: Standard; Pin Count: 2; Value: 10k; Status: Not Recommended; Power: 0.0625W; Manufacturer Part Number: R0402_10K_1%_0.0625W_100PPM; Case: 0402; Mounted: Yes; Sense: No; Socket: No; SMD: Yes; Manufacturer1 Example: YAGEO PHYCOMP; Manufacturer1 ComponentHeight: 0.4mm; HelpURL: \\cern.ch\dfs\Applications\Altium\Datasheets\R0402_Phycomp_RC0402.pdf; Author: CERN DEM JLC; CreateDate: 12/3/2007; LatestRevisionDate: 10/17/2012
R125 = R0402_470R_1%_0.0625W_100PPM: Resistor - 1%; Part Description: General Purpose Thick Film Chip Resistor; Manufacturer: GENERIC; Manufacturer1 Part Number: 232270674701L; TC: ±100ppm/°C; PressFit: No; Part Number: R0402_470R_1%_0.0625W_100PPM; Component Kind: Standard; Component Type: Standard; Pin Count: 2; Value: 470; Status: Not Recommended; Power: 0.0625W; Tolerance: ±1%; Manufacturer Part Number: R0402_470R_1%_0.0625W_100PPM; Case: 0402; Mounted: Yes; Sense: No; Socket: No; SMD: Yes; Manufacturer1 Example: YAGEO PHYCOMP; Manufacturer1 ComponentHeight: 0.4mm; HelpURL: \\cern.ch\dfs\Applications\Altium\Datasheets\R0402_Phycomp_RC0402.pdf; Author: CERN DEM JLC; CreateDate: 12/3/2007; LatestRevisionDate: 10/17/2012

## Sheet Data_Interface.SchDoc: Optocouplers
size A3; Author: M.Beldyga; CompanyName: WUT ISE; DrawnBy: M.Beldyga; Organization: WUT ISE; Address1: PW ISE; Address2: Nowowiejska 15/19 00-665 Warsaw; Address3: micbeldyga@gmail.com; SheetNumber: 6; SheetTotal: 10; ModifiedBy: -; CheckedDate: -; DivGrp: WUT ISE; Designer: M.Beldyga; ModifiedDate: -; ProjectName: Sensor Box
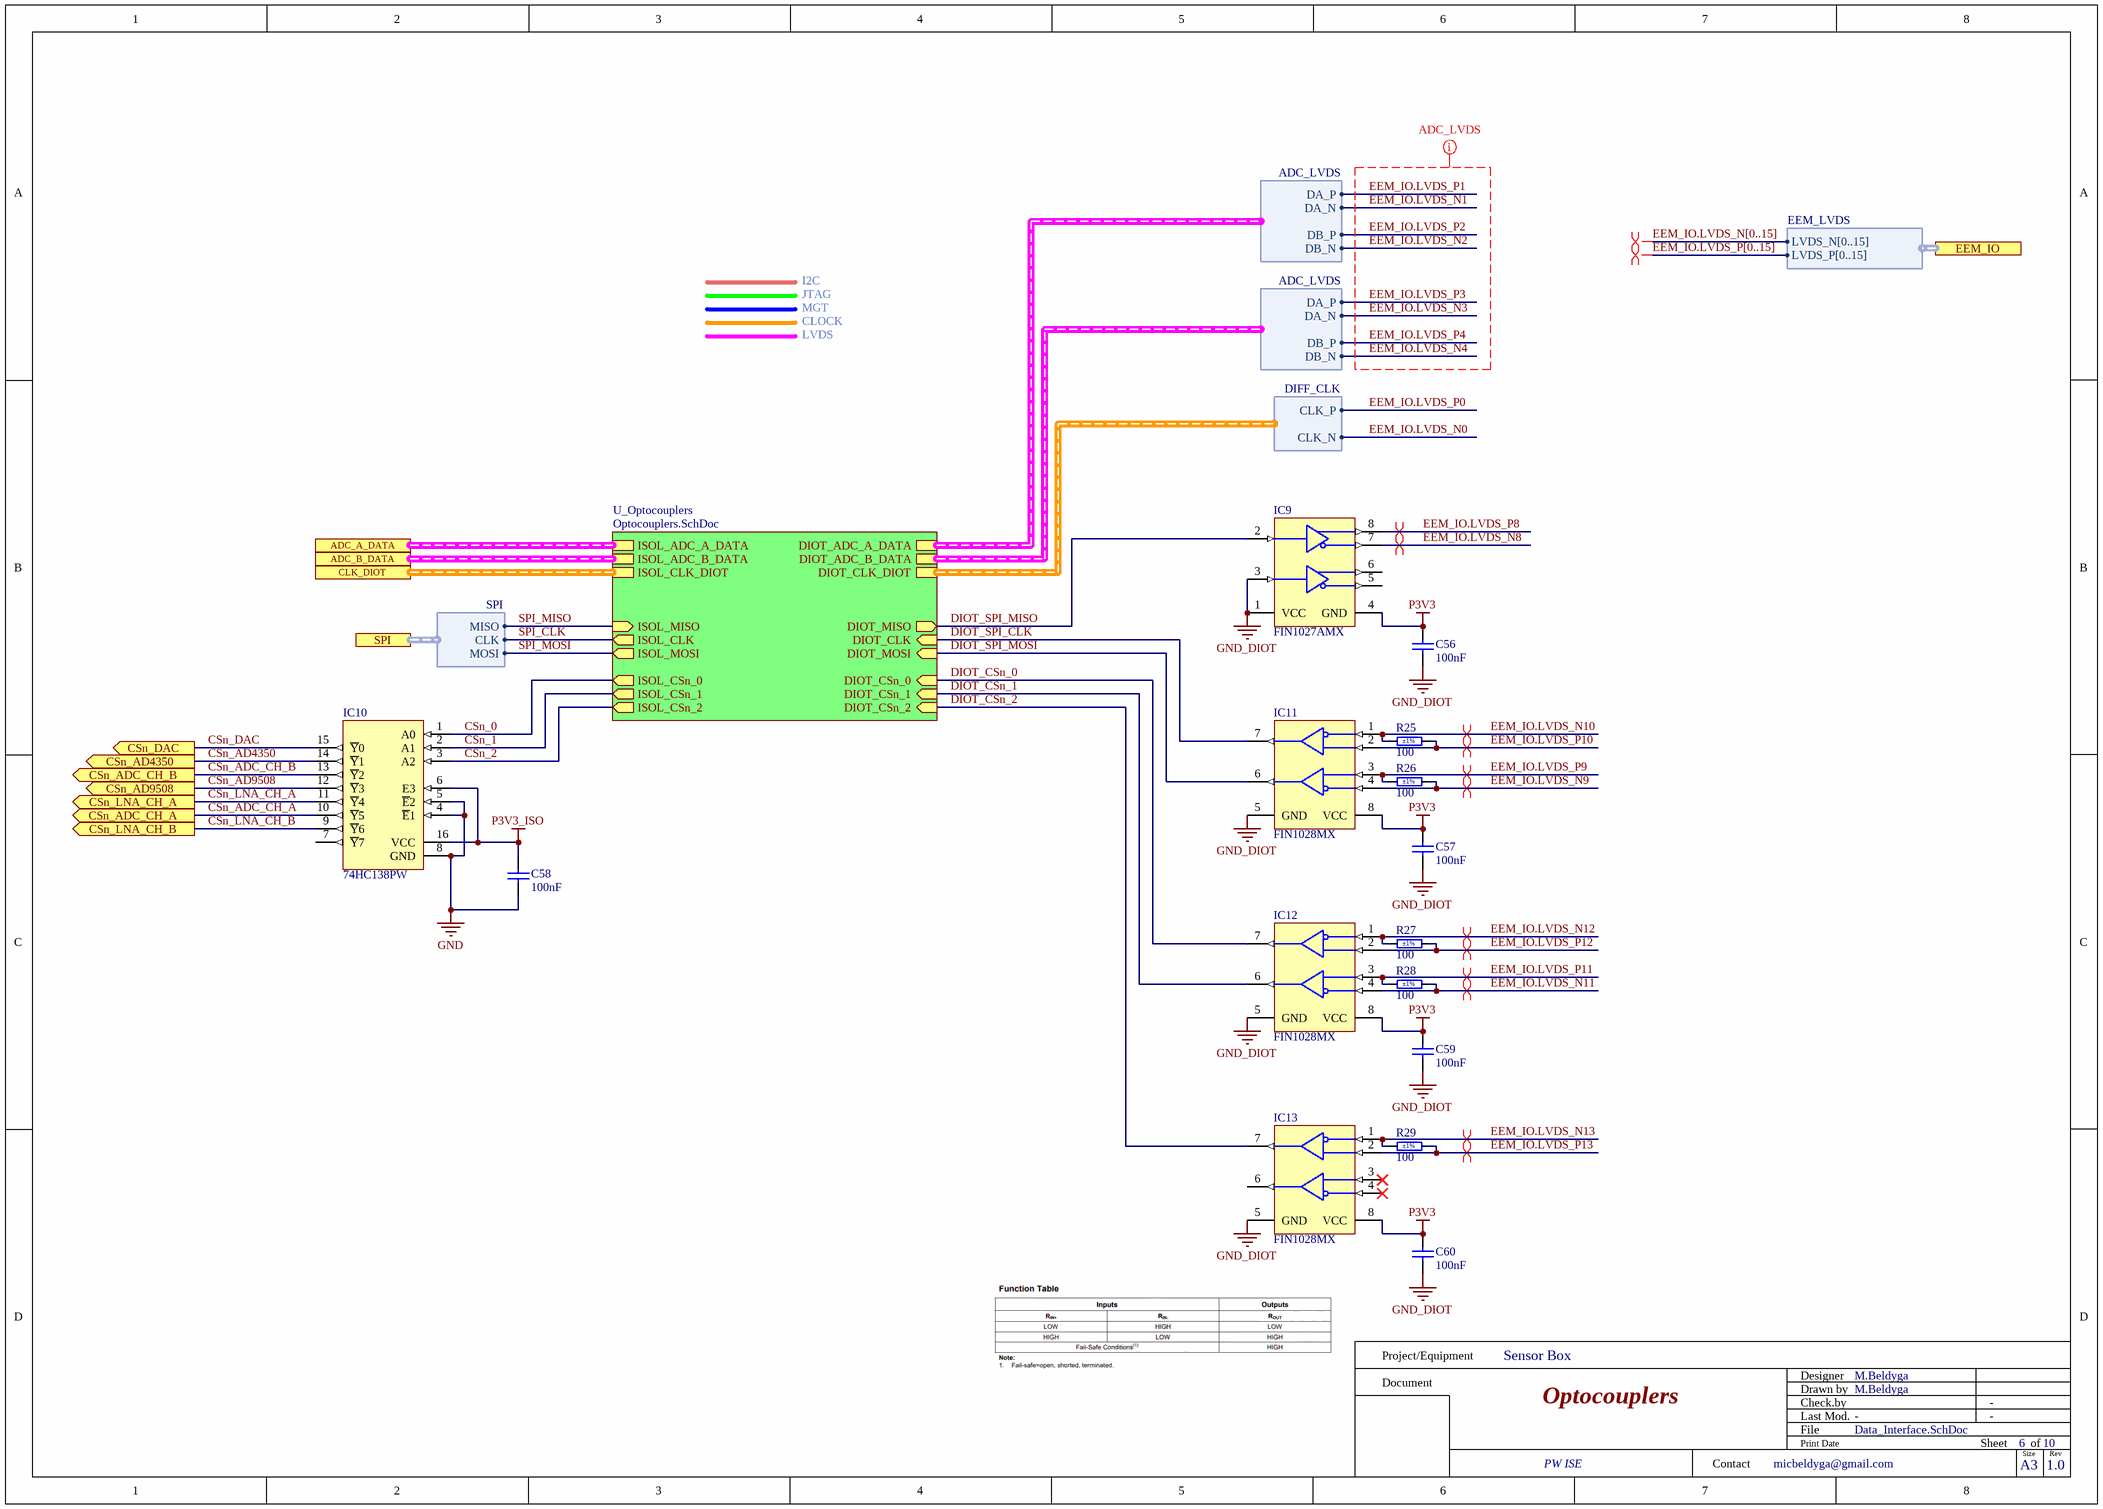
[diagram p6: Data_Interface.SchDoc]

### Parts
C56  100nF  [CAPC1005X55N]
C57  100nF  [CAPC1005X55N]
C58  100nF  [CAPC1005X55N]
C59  100nF  [CAPC1005X55N]
C60  100nF  [CAPC1005X55N]
IC9  FIN1027AMX  [SOIC127P600X175-8N]
IC10  74HC138PW  [SOP65P640X110-16N]
IC11  FIN1028MX  [SOIC127P600X175-8N]
IC12  FIN1028MX  [SOIC127P600X175-8N]
IC13  FIN1028MX  [SOIC127P600X175-8N]
R25  100  Tolerance: ±1%  [RESC1005X40N]
R26  100  Tolerance: ±1%  [RESC1005X40N]
R27  100  Tolerance: ±1%  [RESC1005X40N]
R28  100  Tolerance: ±1%  [RESC1005X40N]
R29  100  Tolerance: ±1%  [RESC1005X40N]

### Sub-sheets
U_Optocouplers = Optocouplers.SchDoc: DIOT_MOSI (in), DIOT_MISO (out), DIOT_CLK (in), DIOT_CSn_0 (in), DIOT_CSn_1 (in), DIOT_CSn_2 (in), ISOL_MOSI (out), ISOL_MISO (in), ISOL_CLK (out), ISOL_CSn_0 (out), ISOL_CSn_1 (out), ISOL_CSn_2 (out), ISOL_ADC_A_DATA (harness ADC_LVDS), ISOL_ADC_B_DATA (harness ADC_LVDS), ISOL_CLK_DIOT (harness DIFF_CLK), DIOT_ADC_A_DATA (harness ADC_LVDS), DIOT_ADC_B_DATA (harness ADC_LVDS), DIOT_CLK_DIOT (harness DIFF_CLK)

### Ports
ADC_A_DATA (harness ADC_LVDS), ADC_B_DATA (harness ADC_LVDS), CLK_DIOT (harness DIFF_CLK), CSn_AD4350 (out), CSn_AD9508 (out), CSn_ADC_CH_A (out), CSn_ADC_CH_B (out), CSn_DAC (out), CSn_LNA_CH_A (out), CSn_LNA_CH_B (out), EEM_IO (harness EEM_LVDS), SPI (harness SPI)

### Harnesses
SPI: CLK, MOSI, MISO
DIFF_CLK: CLK_P, CLK_N
ADC_LVDS: DA_P, DA_N, DB_P, DB_N
EEM_LVDS: LVDS_P[0..15], LVDS_N[0..15]

### Nets
GND: C56.1 C57.1 C58.1 C59.1 C60.1 IC9.1(VCC) IC9.3(DIN2RIN-) IC10.4(~{E}1) IC10.5(~{E}2) IC10.8(GND) IC11.5(GND) IC12.5(GND) IC13.5(GND)  [also labelled GND_DIOT]
P3V3: C56.2 C57.2 C59.2 C60.2 IC9.4(GND) IC11.8(VCC) IC12.8(VCC) IC13.8(VCC)
P3V3_ISO: C58.2 IC10.6(E3) IC10.16(VCC)
CSn_0: IC10.1(A0) ; sheet U_Optocouplers/ISOL_CSn_0
CSn_1: IC10.2(A1) ; sheet U_Optocouplers/ISOL_CSn_1
CSn_2: IC10.3(A2) ; sheet U_Optocouplers/ISOL_CSn_2
CSn_AD4350: IC10.14(~{Y}1) ; port CSn_AD4350
CSn_AD9508: IC10.12(~{Y}3) ; port CSn_AD9508
CSn_ADC_CH_A: IC10.10(~{Y}5) ; port CSn_ADC_CH_A  [project net ADC_CSn]
CSn_ADC_CH_B: IC10.13(~{Y}2) ; port CSn_ADC_CH_B  [project net ADC_CSn]
CSn_DAC: IC10.15(~{Y}0) ; port CSn_DAC
CSn_LNA_CH_A: IC10.11(~{Y}4) ; port CSn_LNA_CH_A
CSn_LNA_CH_B: IC10.9(~{Y}6) ; port CSn_LNA_CH_B
DIOT_CSn_0: IC12.7(ROUT1) ; sheet U_Optocouplers/DIOT_CSn_0
DIOT_CSn_1: IC12.6(ROUT2) ; sheet U_Optocouplers/DIOT_CSn_1
DIOT_CSn_2: IC13.7(ROUT1) ; sheet U_Optocouplers/DIOT_CSn_2
DIOT_SPI_CLK: IC11.7(ROUT1) ; sheet U_Optocouplers/DIOT_CLK
DIOT_SPI_MISO: IC9.2(DIN1) ; sheet U_Optocouplers/DIOT_MISO
DIOT_SPI_MOSI: IC11.6(ROUT2) ; sheet U_Optocouplers/DIOT_MOSI
EEM_IO.LVDS_N8: IC9.7(DOUT-)
EEM_IO.LVDS_N9: IC11.4(RIN2-) R26.1
EEM_IO.LVDS_N10: IC11.1(RIN1-) R25.2
EEM_IO.LVDS_N11: IC12.4(RIN2-) R28.1
EEM_IO.LVDS_N12: IC12.1(RIN1-) R27.2
EEM_IO.LVDS_N13: IC13.1(RIN1-) R29.2
EEM_IO.LVDS_P8: IC9.8(DOUT+)
EEM_IO.LVDS_P9: IC11.3(RIN2+) R26.2
EEM_IO.LVDS_P10: IC11.2(RIN1+) R25.1
EEM_IO.LVDS_P11: IC12.3(RIN2+) R28.2
EEM_IO.LVDS_P12: IC12.2(RIN1+) R27.1
EEM_IO.LVDS_P13: IC13.2(RIN1+) R29.1
SPI_CLK: sheet U_Optocouplers/ISOL_CLK, port SPI.CLK  [project net ADC_SCLK]
SPI_MISO: sheet U_Optocouplers/ISOL_MISO, port SPI.MISO  [project net LNA_MISO]
SPI_MOSI: sheet U_Optocouplers/ISOL_MOSI, port SPI.MOSI  [project net ADC_SDI]

Not connected (* = marked no-connect by the designer): IC9 5(DOUT-) 6(DOUT+); IC10 7(~{Y}7); IC13 3(RIN2+)* 4(RIN2-)* 6(ROUT2)

### Buses and harness runs
bus EEM_IO.LVDS_N[0..15]
bus EEM_IO.LVDS_P[0..15]
harness port ADC_A_DATA = sheet U_Optocouplers/ISOL_ADC_A_DATA
harness port ADC_B_DATA = sheet U_Optocouplers/ISOL_ADC_B_DATA
harness port CLK_DIOT = sheet U_Optocouplers/ISOL_CLK_DIOT

### Layout directives
differential pair; net class D100: (no net found under the mark), EEM_IO.LVDS_N8, EEM_IO.LVDS_N9, EEM_IO.LVDS_N10, EEM_IO.LVDS_N11, EEM_IO.LVDS_N12, EEM_IO.LVDS_N13, EEM_IO.LVDS_P8, EEM_IO.LVDS_P9, EEM_IO.LVDS_P10, EEM_IO.LVDS_P11, EEM_IO.LVDS_P12, EEM_IO.LVDS_P13
net class ADC_LVDS: EEM_IO.LVDS_N1, EEM_IO.LVDS_N2, EEM_IO.LVDS_N3, EEM_IO.LVDS_N4, EEM_IO.LVDS_P1, EEM_IO.LVDS_P2, EEM_IO.LVDS_P3, EEM_IO.LVDS_P4

### Notes on the sheet
- I2C
- JTAG
- MGT
- CLOCK
- LVDS
- Project/Equipment
- Document
- Designer
- Drawn by
- Check.by
- Contact
- File
- Last Mod.
- Print Date
- Sheet
- Size
- A3
- of
- Rev

### Library data of the parts
C56-C60 = CC0402_100NF_50V_10%_X7R: as C1 on sheet CPCIS_Connectors_P1_P6; Part Number: CC0402_100NF_50V_10%_X7R; Component Kind: Standard; Component Type: Standard; Pin Count: 2; Value: 100nF; Status: None; Manufacturer Part Number: CC0402_100NF_50V_10%_X7R; Case: 0402; Mounted: Yes; Socket: No; SMD: Yes; Sense: No; Manufacturer1 Example: MURATA; Manufacturer1 ComponentHeight: 0.55mm; HelpURL: \\cern.ch\dfs\Applications\Altium\Datasheets\CC0402_MURATA_GRM155R71H104KE14D.pdf; Author: CERN DEM MR; CreateDate: 6/30/2017; LatestRevisionDate: 6/30/2017
IC9 = FIN1027A: 3.3V LVDS, 2-Bit, High-Speed, Differential Driver; Manufacturer: ON Semiconductor; PressFit: No; Bonding: No; Part Number: FIN1027AMX; Component Kind: Standard; Component Type: Standard; Device: FIN1027AMX; PackageDescription: SOIC 8, Pitch 1.27mm - Body 4x5mm, IPC Medium Density; Part Description: 3.3V LVDS, 2-Bit, High-Speed, Differential Driver; Manufacturer Part Number: FIN1027AMX; Pin Count: 8; Case: SOIC8; Mounted: Yes; Socket: No; SMD: Yes; Sense: No; ComponentHeight: 0.8mm; Author: GK; HelpURL: \\cern.ch\dfs\Applications\Altium\Datasheets\FIN1101K8X.pdf; CreateDate: 08/11/2016; LatestRevisionDate: 08/11/2016
IC10 = 74HC138PW: 3-Line to 8-Line Decoder/Demultiplexer; Part Description: 3-Line to 8-Line Decoder/Demultiplexer, Inverting; Manufacturer: NXP SEMICONDUCTORS; PressFit: No; Bonding: No; Part Number: 74HC138PW; Component Kind: Standard; Component Type: Standard; Device: 74HC138PW; PackageDescription: SOP, 0.65mm Pitch; 16 Pin, 4.40mm W X 5.00mm L X 1.10mm H body IPC Medium Density; Manufacturer Part Number: 74HC138PW; Pin Count: 16; Case: TSSOP16; Mounted: Yes; Socket: No; SMD: Yes; Sense: No; ComponentHeight: 1.1mm; Author: CERN DEM JLC; HelpURL: \\cern.ch\dfs\Applications\Altium\Datasheets\74HC138PW.pdf; CreateDate: 6/9/2015; LatestRevisionDate: 6/9/2015
IC11-IC13 = FIN1028: 3.3V LVDS 2-Bit High-Speed Differential Reciever; Manufacturer: ON Semiconductor; PressFit: No; Bonding: No; Part Number: FIN1028MX; Component Kind: Standard; Component Type: Standard; Device: FIN1028MX; PackageDescription: SOIC 8, Pitch 1.27mm - Body 4x5mm, IPC Medium Density; Part Description: 3.3V LVDS 2-Bit High-Speed Differential Reciever; Manufacturer Part Number: FIN1028MX; Pin Count: 8; Case: SOIC8; Mounted: Yes; Socket: No; SMD: Yes; Sense: No; ComponentHeight: 0.8mm; Author: GK; HelpURL: \\cern.ch\dfs\Applications\Altium\Datasheets\FIN1101K8X.pdf; CreateDate: 08/11/2016; LatestRevisionDate: 08/11/2016
R25-R29 = R0402_100R_1%_0.0625W_100PPM: Resistor - 1%; Part Description: General Purpose Thick Film Chip Resistor; Manufacturer: GENERIC; Manufacturer1 Part Number: 232270671001L; TC: ±100ppm/°C; PressFit: No; Part Number: R0402_100R_1%_0.0625W_100PPM; Component Kind: Standard; Component Type: Standard; Pin Count: 2; Value: 100; Status: Not Recommended; Power: 0.0625W; Manufacturer Part Number: R0402_100R_1%_0.0625W_100PPM; Case: 0402; Mounted: Yes; Sense: No; Socket: No; SMD: Yes; Manufacturer1 Example: YAGEO PHYCOMP; Manufacturer1 ComponentHeight: 0.4mm; HelpURL: \\cern.ch\dfs\Applications\Altium\Datasheets\R0402_Phycomp_RC0402.pdf; Author: CERN DEM JLC; CreateDate: 12/3/2007; LatestRevisionDate: 10/17/2012